# Altium schematic sheet solar.SchDoc: Photovoltaics
size A4; DrawnBy: J. Reimer T. Yeung M. Au; Organization: UTAT SS; DocumentNumber: 6; Revision: 2.0; SheetNumber: 6; SheetTotal: 17
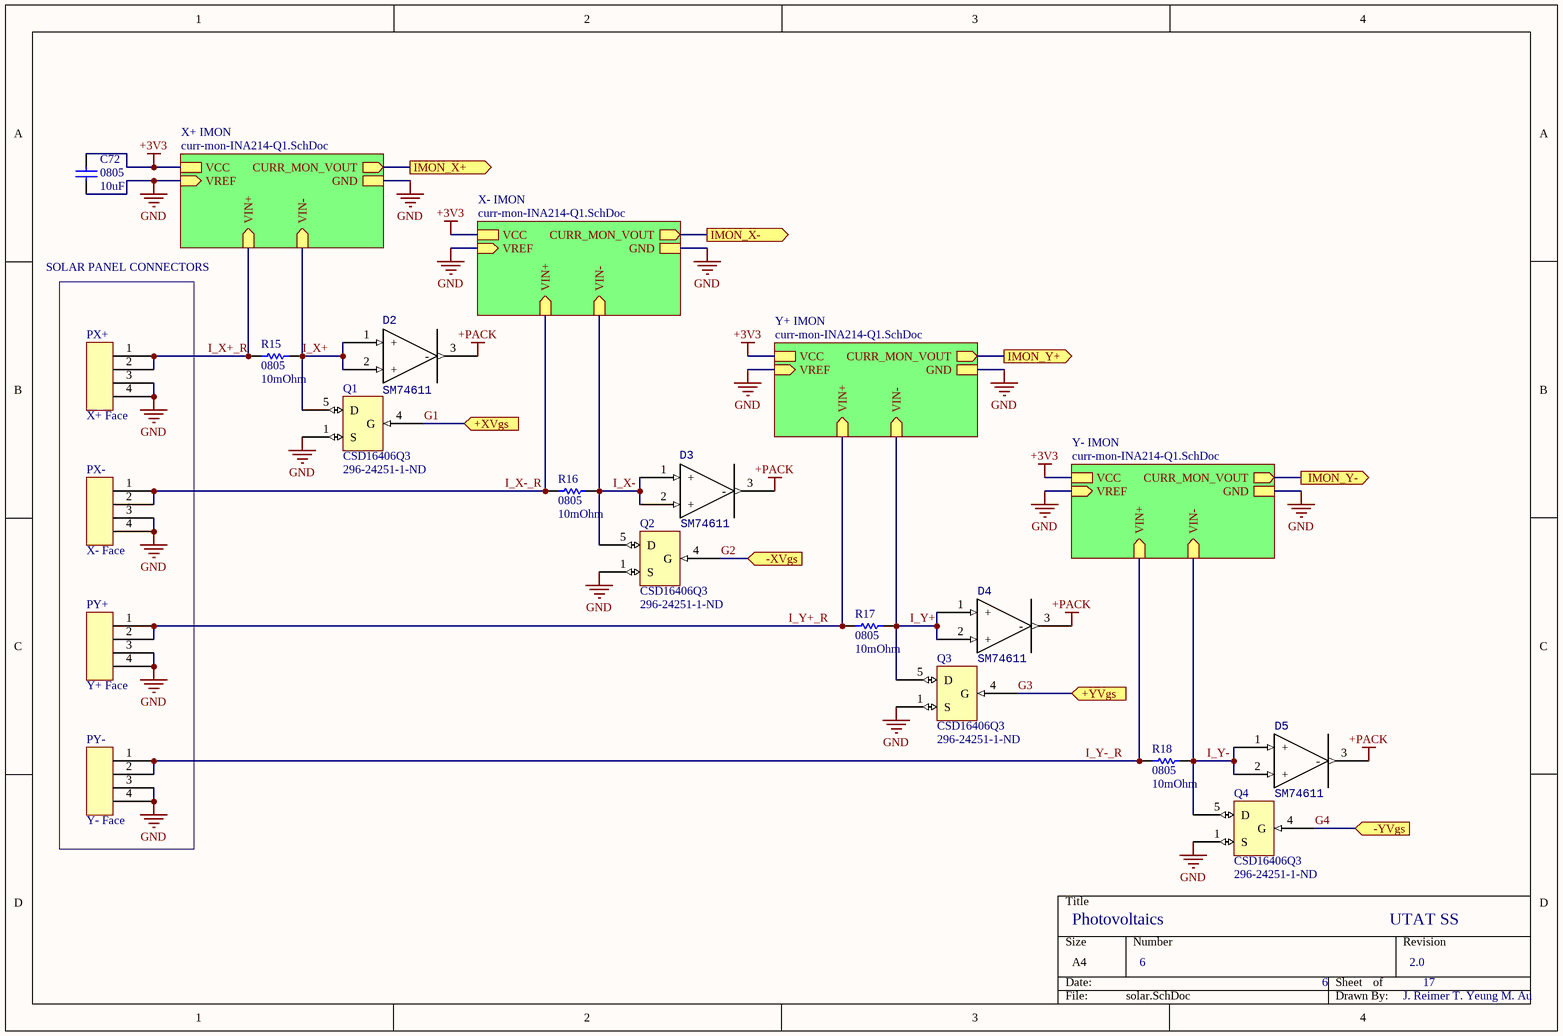
[diagram p0: solar.SchDoc]

## Parts
C72  0805  value 10uF  [CAP0805R]
D2  SM74611  [TO254P1435X464-3N]
D3  SM74611  [TO254P1435X464-3N]
D4  SM74611  [TO254P1435X464-3N]
D5  SM74611  [TO254P1435X464-3N]
PX+  DF13A-4P-1.25H(51)  [DF13A-4P-1.25H(51)]  (value not drawn)
PX-  DF13A-4P-1.25H(51)  [DF13A-4P-1.25H(51)]  (value not drawn)
PY+  DF13A-4P-1.25H(51)  [DF13A-4P-1.25H(51)]  (value not drawn)
PY-  DF13A-4P-1.25H(51)  [DF13A-4P-1.25H(51)]  (value not drawn)
Q1  CSD16406Q3  Supplier Part Number 1: 296-24251-1-ND  [CSD16406Q3]
Q2  CSD16406Q3  Supplier Part Number 1: 296-24251-1-ND  [CSD16406Q3]
Q3  CSD16406Q3  Supplier Part Number 1: 296-24251-1-ND  [CSD16406Q3]
Q4  CSD16406Q3  Supplier Part Number 1: 296-24251-1-ND  [CSD16406Q3]
R15  0805  value 10mOhm  [RES0805R]
R16  0805  value 10mOhm  [RES0805R]
R17  0805  value 10mOhm  [RES0805R]
R18  0805  value 10mOhm  [RES0805R]

## Sub-sheets
X+ IMON = curr-mon-INA214-Q1.SchDoc: VREF (in), VIN+ (in), VCC, GND, VIN- (in), CURR_MON_VOUT (out)
X- IMON = curr-mon-INA214-Q1.SchDoc: VREF (in), VIN+ (in), VCC, GND, VIN- (in), CURR_MON_VOUT (out)
Y+ IMON = curr-mon-INA214-Q1.SchDoc: VREF (in), VIN+ (in), VCC, GND, VIN- (in), CURR_MON_VOUT (out)
Y- IMON = curr-mon-INA214-Q1.SchDoc: VREF (in), VIN+ (in), VCC, GND, VIN- (in), CURR_MON_VOUT (out)

## Ports
+XVgs (in), +YVgs (in), -XVgs (in), -YVgs (in), IMON_X+ (out), IMON_X- (out), IMON_Y+ (out), IMON_Y- (out)

## Nets
+3V3: C72.2 ; sheet Y- IMON/VCC, sheet Y+ IMON/VCC, sheet X- IMON/VCC, sheet X+ IMON/VCC
+PACK: D2.3(-) D3.3(-) D4.3(-) D5.3(-)
GND: C72.1 PX+.3 PX+.4 PX-.3 PX-.4 PY+.3 PY+.4 PY-.3 PY-.4 Q1.1(S) Q2.1(S) Q3.1(S) Q4.1(S) ; sheet Y- IMON/VREF, sheet Y- IMON/GND, sheet Y+ IMON/VREF, sheet Y+ IMON/GND, sheet X- IMON/VREF, sheet X- IMON/GND, sheet X+ IMON/VREF, sheet X+ IMON/GND
G1: Q1.4(G) ; port +XVgs
G2: Q2.4(G) ; port -XVgs
G3: Q3.4(G) ; port +YVgs
G4: Q4.4(G) ; port -YVgs
I_X+: D2.1(+) D2.2(+) Q1.5(D) R15.2 ; sheet X+ IMON/VIN-
I_X+_R: PX+.1 PX+.2 R15.1 ; sheet X+ IMON/VIN+
I_X-: D3.1(+) D3.2(+) Q2.5(D) R16.2 ; sheet X- IMON/VIN-
I_X-_R: PX-.1 PX-.2 R16.1 ; sheet X- IMON/VIN+
I_Y+: D4.1(+) D4.2(+) Q3.5(D) R17.2 ; sheet Y+ IMON/VIN-
I_Y+_R: PY+.1 PY+.2 R17.1 ; sheet Y+ IMON/VIN+
I_Y-: D5.1(+) D5.2(+) Q4.5(D) R18.2 ; sheet Y- IMON/VIN-
I_Y-_R: PY-.1 PY-.2 R18.1 ; sheet Y- IMON/VIN+
IMON_X+: port IMON_X+, sheet X+ IMON/CURR_MON_VOUT
IMON_X-: port IMON_X-, sheet X- IMON/CURR_MON_VOUT
IMON_Y+: port IMON_Y+, sheet Y+ IMON/CURR_MON_VOUT
IMON_Y-: port IMON_Y-, sheet Y- IMON/CURR_MON_VOUT

## Notes on the sheet
- SOLAR PANEL CONNECTORS
- (near PX+) X+ Face
- (near PX-) X- Face
- (near PY+) Y+ Face
- (near PY-) Y- Face

## Library data of the parts
C72 = CAP0805: 0805 capacitor
D2-D5 = SM74611: PV Diode; Manufacturer: Texas Instruments; Manufacturer Part Number: SM74611KTTR; Forward Current: 15A; Peak Reverse Current: 300nA; Max Repetitive Reverse Voltage (Vrrm): 28V; Element Configuration: Single; Number of Outputs: 1; Operating Supply Current: 0pA; Max Supply Voltage: 30V; Min Supply Voltage: 100mV; Max Power Dissipation: 575mW; Supplier 1: Digi-Key; Stock 1: 19774; Pricing 1: 1=3.6, 10=3.236, 100=2.6512 (USD); Mount: Surface Mount; Case/Package: TO-263-3; Number of Pins: 3; Weight: 0.068654oz; Min Operating Temperature: -40°C; Max Operating Temperature: 125°C; Package Quantity: 1; Packaging: Tape and Reel; Output Current: 15A; Average Rectified Current: 15A; Number of Drivers: 1; Quiescent Current: 0pA; Max Reverse Voltage (DC): 30V; Radiation Hardening: No; Lead Free: Contains Lead; REACH SVHC: No SVHC; ComponentLink1URL: http://www.ti.com/lit/ml/mpsf052b/mpsf052b.pdf?keyMatch=ktt%20package%20drawing&tisearch=Search-EN-Everything&src-supplier=Digi-Key; ComponentLink1Description: http://www.ti.com/lit/ml/mpsf052b/mpsf052b.pdf?keyMatch=ktt%20package%20drawing&tisearch=Search-EN-Everything&src-supplier=Digi-Key; Supplier Part Number 1: 296-35688-6-ND
PX+ PX- PY+ PY- = DF13A-4P-1.25H(51): 4 pos DF13 right angle surface mount connector; Supplier 1: Digi-Key; Supplier Part Number 1: H125779CT-ND
Q1-Q4 = CSD16406Q3: Power MOSFET; Manufacturer: Texas Instruments; Rise Time: 12.9ns; Rds On Max: 5.3mR; Input Capacitance: 1.1nF; Nominal Vgs: 1.7V; Dual Supply Voltage: 25V; Continuous Drain Current (ID): 60A; Max Power Dissipation: 2.7W; Fall Time: 4.8ns; Turn-Off Delay Time: 8.5ns; Gate to Source Voltage (Vgs): 16V; Turn-On Delay Time: 7.3ns; Number of Elements: 1; Element Configuration: Single; Supplier 1: Digi-Key; Manufacturer Part Number: CSD16406Q3; Stock 1: 16574; Pricing 1: 1=1.1, 10=0.981, 100=0.7652, 500=0.63212, 1000=0.49904 (USD); Mount: Surface Mount; Case/Package: QFN; Number of Pins: 8; Contact Plating: Tin,Matte; Min Operating Temperature: -55°C; Max Operating Temperature: 150°C; Packaging: Tape and Reel; Package Quantity: 1; Drain to Source Voltage (Vdss): 25V; Drain to Source Breakdown Voltage: 25V; Power Dissipation: 2.7W; Termination: SMD/SMT; Threshold Voltage: 1.7V; Radiation Hardening: No; REACH SVHC: No SVHC; Lead Free: Contains Lead; ComponentLink1URL: http://www.ti.com/general/docs/lit/getliterature.tsp?genericPartNumber=CSD16406Q3&&fileType=pdf&src-supplier=Avnet; ComponentLink1Description: http://www.ti.com/general/docs/lit/getliterature.tsp?genericPartNumber=CSD16406Q3&&fileType=pdf&src-supplier=Avnet; ComponentLink2URL: http://www.ti.com/lit/ds/symlink/csd16406q3.pdf?src-supplier=Digi-Key; ComponentLink2Description: http://www.ti.com/lit/ds/symlink/csd16406q3.pdf?src-supplier=Digi-Key; ComponentLink3URL: http://www.mouser.com/ds/2/405/slps202a-128073.pdf?src-supplier=Mouser; ComponentLink3Description: http://www.mouser.com/ds/2/405/slps202a-128073.pdf?src-supplier=Mouser; ComponentLink4URL: http://www.farnell.com/datasheets/483980.pdf?src-supplier=Farnell; ComponentLink4Description: http://www.farnell.com/datasheets/483980.pdf?src-supplier=Farnell; ComponentLink5URL: http://www.ti.com/general/docs/lit/getliterature.tsp?genericPartNumber=CSD16406Q3&amp;&amp;fileType=pdf&src-supplier=Farnell; ComponentLink5Description: http://www.ti.com/general/docs/lit/getliterature.tsp?genericPartNumber=CSD16406Q3&amp;&amp;fileType=pdf&src-supplier=Farnell; ComponentLink6URL: http://www.farnell.com/simulation/1744921.zip?src-supplier=Element14; ComponentLink6Description: http://www.farnell.com/simulation/1744921.zip?src-supplier=Element14
R15-R18 = RES0805: 0805 resistor; Manufacturer: Panasonic; Manufacturer Part Number: ERJ-8BWJR010V; Resistance: 10mR; Power Rating: 1W; Tolerance: 5%; Temperature Coefficient: 200ppm/°C; Supplier 1: Digi-Key; Supplier Part Number 1: P.010AVDKR-ND; Stock 1: 70650; Pricing 1: 1=0.68, 10=0.5, 100=0.2911, 1000=0.16327, 2500=0.15763 (USD); Mount: Surface Mount; Case/Package: 1206; Case Code (Imperial): 1206; Case Code (Metric): 3216; Contact Plating: Tin; Min Operating Temperature: -55°C; Max Operating Temperature: 155°C; Packaging: Tape and Reel; Package Quantity: 1; Termination: SMD/SMT; Composition: Thick Film; Number of Terminations: 2; Military Standard: Not; Max Power Dissipation: 1W; Features: Automotive AEC-Q200; Length: 3.2mm; Height: 0.65mm; Width: 1.6mm; Depth: 1.6mm; Radiation Hardening: No; Lead Free: Lead Free; ComponentLink1URL: http://industrial.panasonic.com/www-data/pdf/AOA0000/AOA0000CE3.pdf?src-supplier=Avnet; ComponentLink1Description: http://industrial.panasonic.com/www-data/pdf/AOA0000/AOA0000CE3.pdf?src-supplier=Avnet; ComponentLink2URL: https://industrial.panasonic.com/cdbs/www-data/pdf/RDN0000/AOA0000C313.pdf?src-supplier=Digi-Key; ComponentLink2Description: https://industrial.panasonic.com/cdbs/www-data/pdf/RDN0000/AOA0000C313.pdf?src-supplier=Digi-Key; ComponentLink3URL: http://uk.rs-online.com/webdocs/13b8/0900766b813b869e.pdf?src-supplier=RSComponents; ComponentLink3Description: http://uk.rs-online.com/webdocs/13b8/0900766b813b869e.pdf?src-supplier=RSComponents